# EAGLE design Bawah (EAGLE 9.4.2)
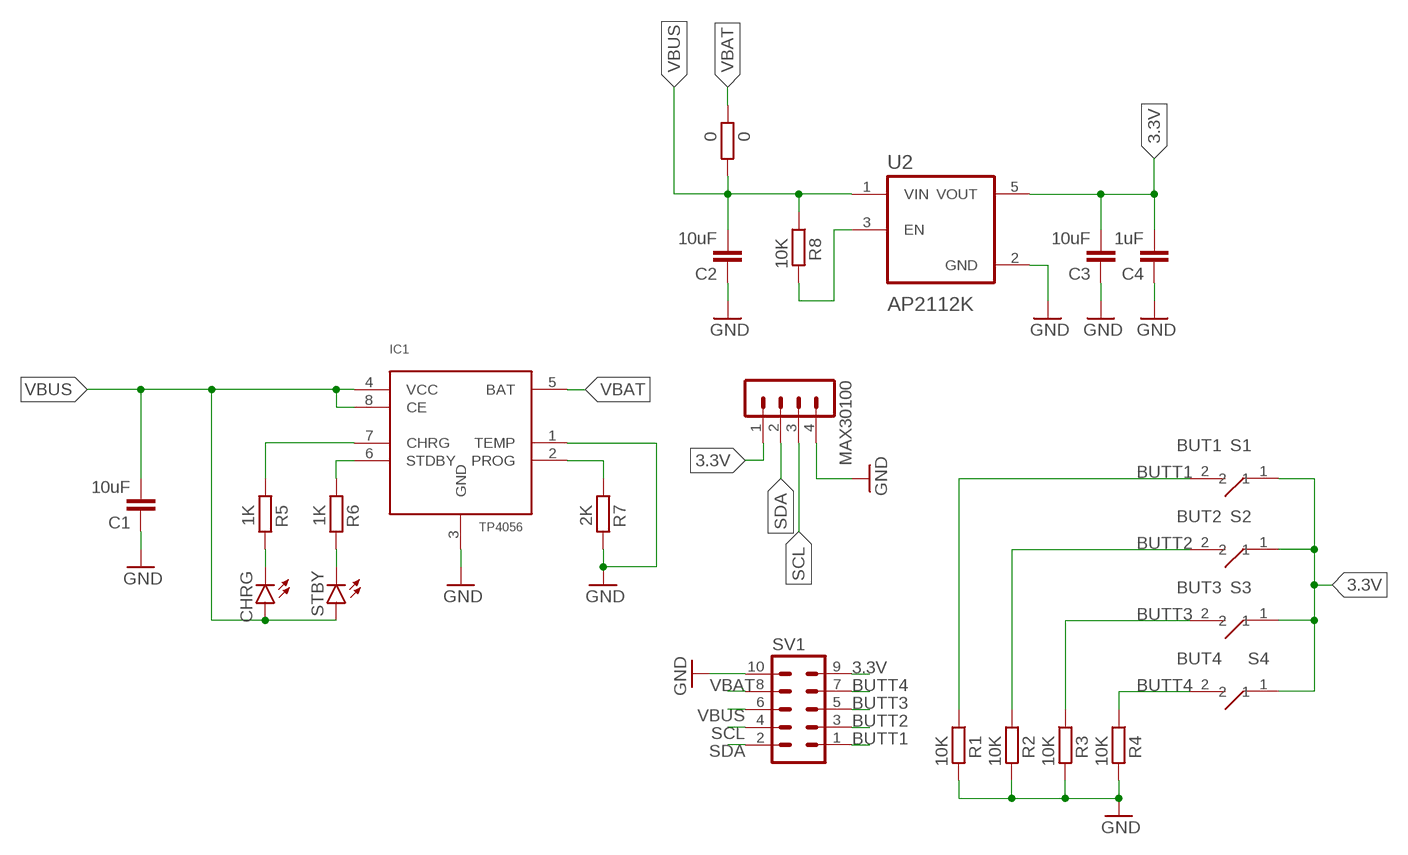
[diagram p0: schematic, sheet 1]

## Parts
0  0  R-EU_R0805  [R0805]
C1  10uF  C-EUC0805  [C0805]
C2  10uF  C-EUC0805  [C0805]
C3  10uF  C-EUC0805  [C0805]
C4  1uF  C-EUC0805  [C0805]
CHRG  LEDCHIPLED_0805  [CHIPLED_0805]
IC1  TP4056  [SOP-8]
MAX30100  MA04-1  [MA04-1]
R1  10K  R-EU_R0805  [R0805]
R2  10K  R-EU_R0805  [R0805]
R3  10K  R-EU_R0805  [R0805]
R4  10K  R-EU_R0805  [R0805]
R5  1K  R-EU_R0805  [R0805]
R6  1K  R-EU_R0805  [R0805]
R7  2K  R-EU_R0805  [R0805]
R8  10K  R-EU_R0805  [R0805]
S1  BUT1  SIDE_SWITCH  [SIDE_SWITCH]
S2  BUT2  SIDE_SWITCH  [SIDE_SWITCH]
S3  BUT3  SIDE_SWITCH  [SIDE_SWITCH]
S4  BUT4  SIDE_SWITCH  [SIDE_SWITCH]
STBY  LEDCHIPLED_0805  [CHIPLED_0805]
SV1  MA05-2  [MA05-2]
U2  AP2112K  AP2112K-3.3TRG1  [SOT95P285X140-5N]

## Nets
3.3V: C3.2 C4.2 MAX30100.1 S1.1 S2.1 S3.1 S4.1 SV1.9 U2.5(VOUT)
BUTT1: R1.1 S1.2 SV1.1
BUTT2: R2.1 S2.2 SV1.3
BUTT3: R3.1 S3.2 SV1.5
BUTT4: R4.1 S4.2 SV1.7
GND: C1.1 C2.1 C3.1 C4.1 IC1.1(TEMP) IC1.3(GND) MAX30100.4 R1.2 R2.2 R3.2 R4.2 R7.2 SV1.10 U2.2(GND)
N$7: IC1.6(STDBY) R6.1
N$8: R8.2 U2.3(EN)
N$9: IC1.7(CHRG) R5.1
N$10: CHRG.C R5.2
N$11: R6.2 STBY.C
N$12: IC1.2(PROG) R7.1
SCL: MAX30100.3 SV1.4
SDA: MAX30100.2 SV1.2
VBAT: 0.1 IC1.5(BAT) SV1.8
VBUS: 0.2 C1.2 C2.2 CHRG.A IC1.4(VCC) IC1.8(CE) R8.1 STBY.A SV1.6 U2.1(VIN)

## Library data of the parts
0 R1-R8 = rcl:R-EU_: RESISTOR, European symbol; SPICEPREFIX: R
C1-C4 = rcl:C-EU: CAPACITOR, European symbol; SPICEPREFIX: C
CHRG STBY = led:LED: LED OSRAM: - CHIPLED LG R971, LG N971, LY N971, LG Q971, LY Q971, LO R971, LY R971 LH N974, LH R974 LS Q976, LO Q976, LY Q976 LO Q996 - Hyper CHIPLED LW Q18S LB Q993, LB Q99A, LB R99A - SideLED LS A670, LO A670, LY A670, LG A670, LP A670 LB A673, LV A673, LT A673, LW A673 LH A674 LY A675 LS A676, LA A676, LO A676, LY A676, LW A676 LS A679, LY A679, LG A679 - Hyper Micro SIDELED® LS Y876, LA Y876, LO Y876, LY Y876 LT Y87S - SmartLED LW L88C, LW L88S LB L89C, LB L89S, LG L890 LS L89K, LO L89K, LY L89K LS L896, LA L896, LO L896, LY L896 - TOPLED LS T670, LO T670, LY T670, LG T670, LP T670 LSG T670, LSP T670, LSY T670, LOP T670, LYG T670 LG T671, LOG T671, LSG T671 LB T673, LV T673, LT T673, LW T673 LH T674 LS T676, LA T676, LO T676, LY T676, LB T676, LH T676, LSB T676, LW T676 LB T67C, LV T67C, LT T67C, LS T67K, LO T67K, LY T67K, LW E67C LS E67B, LA E67B, LO E67B, LY E67B, LB E67C, LV E67C, LT E67C LW T67C LS T679, LY T679, LG T679 LS T770, LO T770, LY T770, LG T770, LP T770 LB T773, LV T773, LT T773, LW T773 LH T774 LS E675, LA E675, LY E675, LS T675 LS T776, LA T776, LO T776, LY T776, LB T776 LHGB T686 LT T68C, LB T68C - Hyper Mini TOPLED® LB M676 - Mini TOPLED Santana® LG M470 LS M47K, LO M47K, LY M47K Source: http://www.osram.convergy.de LUXEON: - LUMILED® LXK2-PW12-R00, LXK2-PW12-S00, LXK2-PW14-U00, LXK2-PW14-V00 LXK2-PM12-R00, LXK2-PM12-S00, LXK2-PM14-U00 LXK2-PE12-Q00, LXK2-PE12-R00, LXK2-PE12-S00, LXK2-PE14-T00, LXK2-PE14-U00 LXK2-PB12-K00, LXK2-PB12-L00, LXK2-PB12-M00, LXK2-PB14-N00, LXK2-PB14-P00, LXK2-PB14-Q00 LXK2-PR12-L00, LXK2-PR12-M00, LXK2-PR14-Q00, LXK2-PR14-R00 LXK2-PD12-Q00, LXK2-PD12-R00, LXK2-PD12-S00 LXK2-PH12-R00, LXK2-PH12-S00 LXK2-PL12-P00, LXK2-PL12-Q00, LXK2-PL12-R00 Source: www.luxeon.com KINGBRIGHT: KA-3528ASYC Source: www.kingbright.com
IC1 = TP4056:TP4056; AVAILABILITY: Unavailable; MF: NanJing Top Power ASIC Corp.; MP: TP4056; PACKAGE: Package Analog Devices; PRICE: None
MAX30100 = con-lstb:MA04-1: PIN HEADER; OC_FARNELL: unknown; OC_NEWARK: unknown
S1-S4 = side-button:SIDE_SWITCH
SV1 = con-lstb:MA05-2: PIN HEADER; OC_FARNELL: unknown; OC_NEWARK: unknown
U2 = AP2112K-3.3TRG1:AP2112K-3.3TRG1: AP2112 Series 0.6 A 3.3 V Fixed Output SMT LDO Linear Regulator - SOT23-5; AVAILABILITY: Unavailable; DESCRIPTION: AP2112 Series 0.6 A 3.3 V Fixed Output SMT LDO Linear Regulator - SOT23-5; MF: Diodes Inc.; MP: AP2112K-3.3TRG1; PACKAGE: SOT-753 Diodes Inc.; PRICE: None

## Board
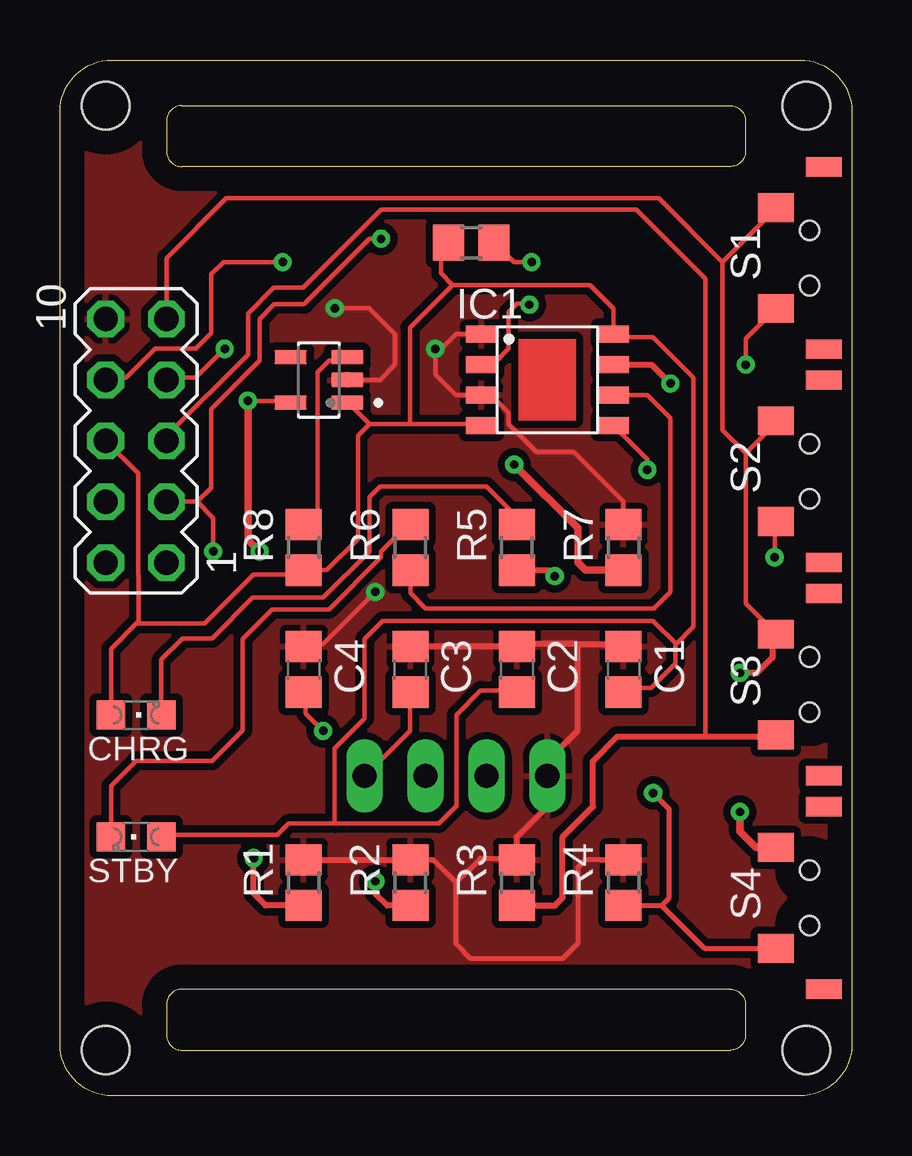
[diagram p1: board, top side]
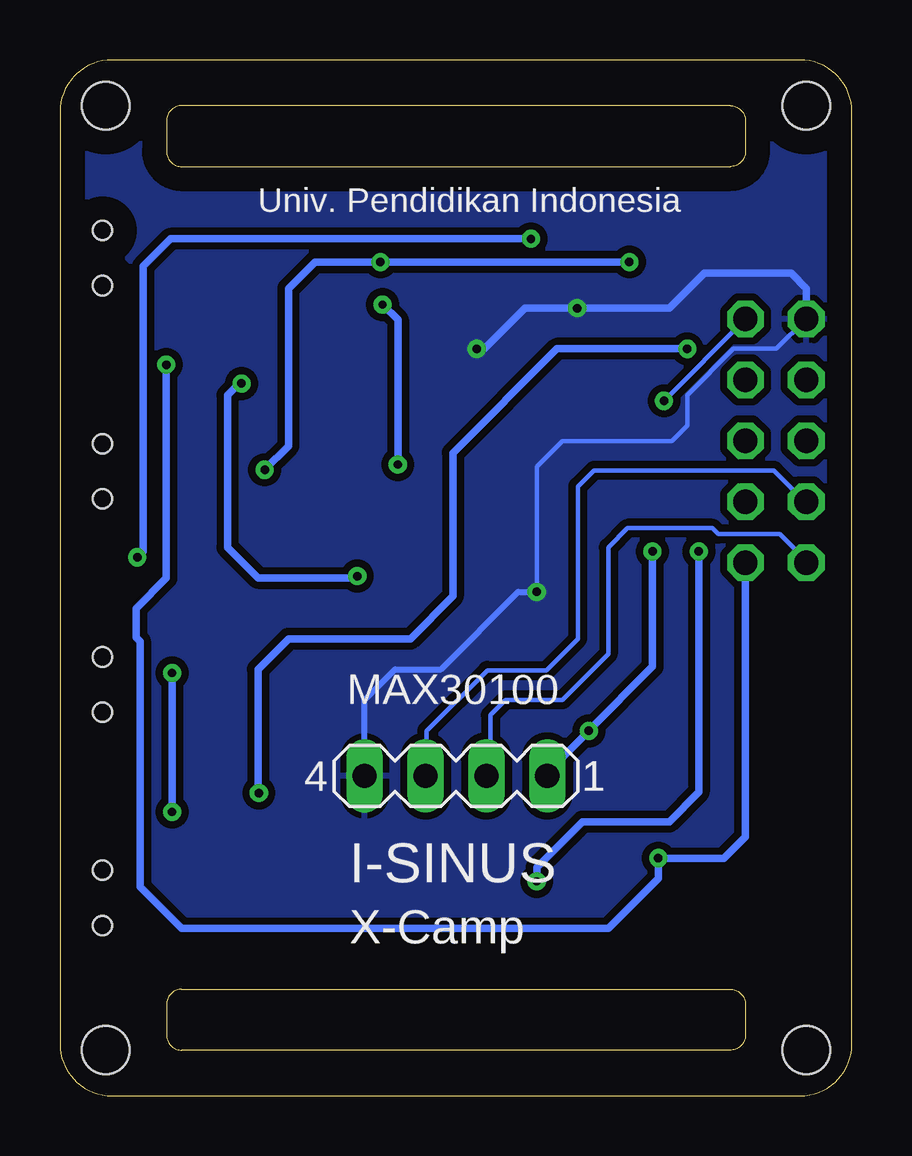
[diagram p2: board, bottom side, seen from below]

Size 33.02 x 43.18 mm. Coordinates in mm from the lower left corner, seen from the top.
Outline: 33.02,39.11 33.02,3.44
Outline: 4.45,40.64 4.45,39.37 arc90 5.08,38.73 27.94,38.73 arc90 28.57,39.37 28.57,40.64 arc90 27.94,41.27 5.08,41.27 arc90 4.45,40.64
Outline: 27.94,4.45 5.08,4.45 arc90 4.45,3.81 4.45,2.54 arc90 5.08,1.91 27.94,1.91 arc90 28.57,2.54 28.57,3.81 arc90 27.94,4.45
Outline: 30.85,0 2.17,0 arc-90 0,2.17 0,41.01 arc-90 2.17,43.18 30.85,43.18 arc-90 33.02,41.01 33.02,2.17 arc-90 30.85,0
Copper layers (1*16): Top 0.035mm / dielectric 1.5mm / Bottom 0.035mm
Design rules "default *": minimum track width 7mil, minimum drill 0.35mm, track to track 12mil, track to pad 12mil, pad to pad 12mil, via to via 12mil, smd to smd 12mil, copper to edge 40mil, drill to drill 10mil, minimum pad ring 10mil, minimum via ring 8mil, stop-mask expansion 4mil, vias tented up to drill 0mil, thermal gap 10mil
Holes 2 mm at 1.91,1.91 1.91,41.27 31.12,41.27 31.12,1.91

### Footprints (pad centres in the part's own frame; a part is rotated, then mirrored left to right if it is on the bottom)
R0805 = smd 1.3 x 1.5: 1 -0.95,0; 2 0.95,0
C0805 = smd 1.3 x 1.5: 1 -0.95,0; 2 0.95,0
CHIPLED_0805 = smd 1.2 x 1.2: A 0,-1.05; C 0,1.05
SOP-8 = smd 1.3 x 0.7: 1 -2.75,1.905; 2 -2.75,0.635; 3 -2.75,-0.635; 4 -2.75,-1.905; 5 2.75,-1.905; 6 2.75,-0.635; 7 2.75,0.635; 8 2.75,1.905
MA04-1 = drill 1.016 long: 1 -3.81,0; 2 -1.27,0; 3 1.27,0; 4 3.81,0
SIDE_SWITCH = smd 1.2 x 1.5: 1 -2.1,0; 2 2.1,0 | smd 0.8 x 1.5: 3 -3.8,2; 4 3.8,2 | hole 0.8: -1.15,1.4; 1.15,1.4
MA05-2 = drill 1.016 octagon: 1 -5.08,-1.27; 2 -5.08,1.27; 3 -2.54,-1.27; 4 -2.54,1.27; 5 0,-1.27; 6 0,1.27; 7 2.54,-1.27; 8 2.54,1.27; 9 5.08,-1.27; 10 5.08,1.27
SOT95P285X140-5N = smd 1.35 x 0.6: 1 -1.185,0.95; 2 -1.185,0; 3 -1.185,-0.95; 4 1.185,-0.95; 5 1.185,0.95

### Placement (x,y rotation side)
0  17.14,35.56 180 top
C1  23.5,17.78 270 top
C2  19.05,17.78 270 top
C3  14.61,17.78 270 top
C4  10.16,17.78 270 top
CHRG  3.17,15.88 270 top
IC1  20.32,29.84 0 top
MAX30100  16.51,13.34 180 bottom
R1  10.16,8.89 90 top
R2  14.61,8.89 90 top
R3  19.05,8.89 90 top
R4  23.5,8.89 90 top
R5  19.05,22.86 90 top
R6  14.61,22.86 90 top
R7  23.5,22.86 90 top
R8  10.16,22.86 90 top
S1  29.84,34.92 270 top
S2  29.84,26.03 270 top
S3  29.84,17.14 270 top
S4  29.84,8.25 270 top
STBY  3.17,10.79 90 top
SV1  3.17,27.3 90 top
U2  10.8,29.84 180 top

### Tracks (layer width: path | path; a pad name or v marks a point on that pad's centre or on a via)
3.3V  (via drill 0.35)
  Top 0.178: 28.59,26.8 29.79,28 S2.1 | 28.59,26.8 28.59,20.52 29.79,19.32 S3.1 | 27.62,34.76 29.79,36.93 S1.1 | 27.62,34.76 27.62,27.76 28.59,26.8 | v10.97,15.21 10.25,15.94 10.25,16.66 C4.2 | C3.2 14.59,16.66 14.59,15.21 12.9,13.53 MAX30100.1 | v7.84,28.97 9.52,28.97 U2.5 | SV1.9 4.45,34.92 6.93,37.41 24.97,37.41 27.62,34.76
  Top 0.254: S3.1 29.84,19.08 29.7,18.93 29.7,18.27 29.06,17.63 v28.35,17.63
  Top 0.305: v7.84,28.97 7.84,23.18 v8.32,22.7 | S4.1 29.02,10.36 28.35,11.02 v28.35,11.84
  Bottom 0.178: v7.84,28.97 4.46,32.35 SV1.9 | 10.97,15.24 v10.97,15.21
  Bottom 0.305: v28.35,17.63 v28.35,11.84 | v8.32,22.7 8.32,17.89 10.97,15.24 | v10.97,15.21 12.7,13.49 MAX30100.1
BUTT1  (via drill 0.35)
  Top 0.178: v28.59,30.48 28.59,31.57 S1.2
  Top 0.254: R1.1 8.57,7.94 8.08,8.43 v8.08,9.91
  Bottom 0.305: v28.59,30.48 28.59,21.58 29.84,20.32 29.84,19.11 29.68,18.95 29.68,8.72 27.94,6.99 10.16,6.99 8.08,9.07 v8.08,9.91 5.33,9.91 4.45,10.79 SV1.1
BUTT2  (via drill 0.35)
  Top 0.178: v29.79,22.45 29.79,23.9 S2.2 | v13.39,35.73 12.9,35.73 10.18,33 8.93,33 8.32,32.38 8.32,30.66 6.29,28.63 6.29,25.34 5.72,24.77 | SV1.3 5.72,24.77 | v6.39,22.7 6.39,24.09 5.72,24.77
  Top 0.254: R2.1 13.65,7.94 13.14,8.45 v13.14,8.94
  Bottom 0.305: v13.39,35.73 28.41,35.73 29.55,34.58 29.55,22.7 v29.79,22.45 | v6.39,22.7 6.39,12.66 7.62,11.43 11.24,11.43 13.14,9.53 v13.14,8.94
BUTT3
  Top 0.178: 29.79,14.97 S3.2 | SV1.5 4.46,27.52 7.84,30.9 7.84,32.6 8.91,33.68 10.14,33.68 13.39,36.93 13.97,36.93 24.03,36.93 26.9,34.06 26.9,14.97
  Top 0.254: R3.1 20.64,7.94 20.96,8.25 20.96,10.79 22.23,12.07 22.23,13.97 23.23,14.97 26.67,14.97 26.9,14.97 29.79,14.97
BUTT4  (via drill 0.35)
  Top 0.178: v6.87,31.14 5.66,29.93 4.46,29.93 SV1.7
  Top 0.203: S4.2 26.87,6.16 25.08,7.94 R4.1 25.09,7.94 25.4,8.25 25.4,11.95 v24.73,12.62
  Bottom 0.305: v6.87,31.14 12.29,31.14 16.64,26.8 16.64,20.83 18.41,19.05 23.5,19.05 24.77,17.78 24.77,12.66 v24.73,12.62
GND  (via drill 0.35)
  Top 0.178: 19.18,18.83 C2.1 | v13.14,21.01 10.97,18.83 10.25,18.83 C4.1 | R3.2 19.18,9.91 19.05,9.91 | v11.45,32.83 12.89,32.83 13.97,31.75 13.97,30.48 13.34,29.84 U2.2 | IC1.1 16.51,31.75 15.9,31.14 v15.65,31.14 15.65,30.07 16.51,29.21 IC1.3 17.97,29.21 18.69,28.49 18.69,28 19.86,26.84 21.42,26.84 23.5,24.77 R7.2
  Top 0.203: R4.2 21.91,9.84 21.59,9.53 21.59,6.35 20.96,5.71 17.14,5.71 16.51,6.35 16.51,8.89 | 16.51,8.89 17.53,9.91 19.05,9.91 | 16.51,8.89 15.56,9.84 R2.2
  Top 0.254: R3.2 19.05,10.79 20.32,12.07 MAX30100.4 20.32,13.97 21.59,15.24 21.59,18.83 | 21.59,18.83 23.39,18.83 C1.1 | 21.59,18.83 19.18,18.83 | C2.1 C3.1 | R1.2 R2.2
  Bottom 0.178: 11.43,32.83 v11.45,32.83 | SV1.10 3.15,31.14 4.94,31.14 6.87,29.21 6.87,27.94 7.51,27.3 12.07,27.3 13.14,26.23 v13.14,21.01
  Bottom 0.254: MAX30100.4 20.32,16.51 19.05,17.78 17.14,17.78 13.92,21.01 v13.14,21.01
  Bottom 0.305: SV1.10 1.91,33.66 2.54,34.29 6.16,34.29 7.62,32.83 11.43,32.83 | v11.45,32.83 13.63,32.83 15.32,31.14 v15.65,31.14
  pour Bottom: 0,2.17 0,41.01 arc-90 2.17,43.18 30.85,43.18 arc-90 33.02,41.01 33.02,2.17 arc-90 30.85,0 2.17,0 arc-90
  pour Top: 0,2.17 0,41.01 arc-90 2.17,43.18 30.85,43.18 arc-90 33.02,41.01 33.02,2.17 arc-90 30.85,0 2.17,0 arc-90
N$7
  Top 0.178: IC1.6 24.49,29.21 25.45,28.24 25.45,21.01 24.77,20.32 15.24,20.32 14.61,20.95 R6.1
N$8
  Top 0.178: U2.3 11.94,30.66 11.21,30.66 10.73,30.17 10.73,24.38 10.25,23.9 R8.2
N$9  (via drill 0.35)
  Top 0.254: R5.1 20.38,21.91 v20.62,21.67 | IC1.7 24.66,30.48 v25.45,29.69
  Bottom 0.305: v25.45,29.69 25.55,29.69 26.04,29.21 26.04,22.86 24.77,21.59 20.7,21.59 v20.62,21.67
N$10
  Top 0.178: R5.2 19.05,24.13 17.78,25.4 13.34,25.4 12.9,24.97 12.9,22.7 10.97,20.76 8.04,20.76 6.35,19.07 5.1,19.07 4.22,18.2 CHRG.C
N$11
  Top 0.178: R6.2 14.59,23.9 13.39,22.7 13.39,22.45 11.21,20.28 8.85,20.28 7.62,19.05 7.62,15.24 6.35,13.97 3.17,13.97 2.12,12.92 STBY.C
N$12  (via drill 0.35)
  Top 0.178: IC1.2 17.73,30.66 18.21,30.66 18.69,31.14 18.69,32.66 19.05,33.02 19.53,33.02 v19.57,32.98
  Top 0.305: v18.94,26.31 21.59,23.66 21.59,22.23 21.91,21.91 R7.1
  Bottom 0.305: v19.57,32.98 18.94,32.35 v18.94,26.31
SCL
  Bottom 0.178: MAX30100.3 17.73,13.53 17.73,15.21 15.2,17.74 12.74,17.74 11.43,19.05 11.43,25.4 10.76,26.07 3.25,26.07 2.04,24.87 SV1.4
SDA
  Bottom 0.178: MAX30100.2 15.07,13.53 15.07,15.88 14.44,16.51 12.07,16.51 10.16,18.41 10.16,22.86 9.36,23.66 5.82,23.66 5.58,23.42 3.01,23.42 2.04,22.45 SV1.2
VBAT  (via drill 0.35)
  Top 0.178: IC1.5 24.49,26.52 v24.49,26.1 | v19.66,34.76 18.94,34.76 18.21,35.48 0.1 | SV1.8 2.04,29.93 2.77,29.93 3.97,31.14 5.66,31.14 6.31,31.79 6.31,34.25 6.82,34.76 v9.28,34.76
  Bottom 0.305: v9.28,34.76 v19.66,34.76 22.39,34.76 23.5,33.66 23.5,27.09 v24.49,26.1
VBUS
  Top 0.178: 11.45,11.35 15.8,11.35 16.52,12.08 16.52,15.89 17.54,16.9 18.94,16.9 C2.2 | 11.45,11.35 9.52,11.35 9.04,10.87 4.46,10.87 STBY.A | 12.9,28 14.59,28 | 14.59,28 17.49,28 IC1.4 | 12.9,28 12.18,28.73 U2.1 | 25.69,18.83 26.42,19.56 26.42,29.93 24.73,31.62 23.28,31.62 IC1.8 23.07,32.81 22.09,33.8 16.37,33.8 | 25.69,18.83 25.65,18.8 25.65,18.03 24.63,17.01 23.63,17.01 23.52,16.9 C1.2 | 14.59,28 14.59,32.02 16.37,33.8 | 11.45,11.35 11.45,14.49 12.7,15.73 12.7,19.05 13.45,19.8 24.73,19.8 25.69,18.83 | 12.9,28 12.42,27.52 12.42,23.22 11.11,21.91 R8.1 10.01,21.73 8.08,21.73 6.03,19.69 3.17,19.69 | CHRG.A 2.12,18.63 3.17,19.69 | 3.17,19.69 3.28,19.79 3.28,21.7 3.25,21.73 3.25,25.96 SV1.6 | 16.37,33.8 15.88,34.29 15.88,35.24 0.2

### Text on the board
bNames: Univ. Pendidikan Indonesia | I-SINUS | X-Camp